# EAGLE design alim (EAGLE 8.7.0)
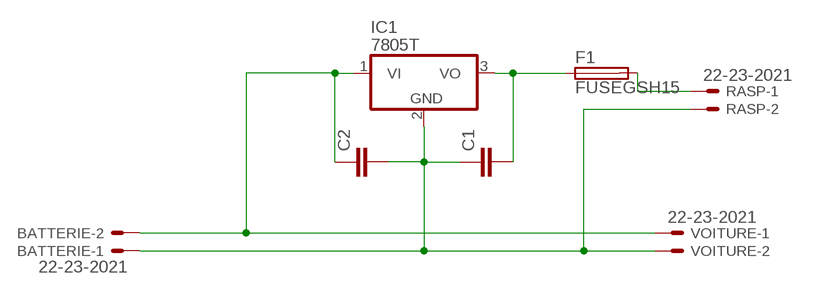
[diagram p0: schematic, sheet 1]

## Parts
BATTERIE  22-23-2021  [22-23-2021]
C1  C-EU025-025X050  [C025-025X050]
C2  C-EU025-025X050  [C025-025X050]
F1  FUSEGSH15  [GSH15]
IC1  7805T  [TO220H]
RASP  22-23-2021  [22-23-2021]
VOITURE  22-23-2021  [22-23-2021]

## Nets
N$1: BATTERIE.2 C2.1 IC1.1(VI) VOITURE.1
N$2: BATTERIE.1 C1.1 C2.2 IC1.2(GND) RASP.2 VOITURE.2
N$3: C1.2 F1.1 IC1.3(VO)
N$4: F1.2 RASP.1

## Library data of the parts
BATTERIE RASP VOITURE = con-molex:22-23-2021: .100" (2.54mm) Center Header - 2 Pin; MF: MOLEX; MPN: 22-23-2021; OC_FARNELL: 1462926; OC_NEWARK: 25C3832
C1 C2 = rcl:C-EU: CAPACITOR, European symbol; SPICEPREFIX: C
F1 = fuse:FUSE: Fuse; OC_FARNELL: unknown; OC_NEWARK: unknown
IC1 = linear:78*: Positive VOLTAGE REGULATOR Source: http://cache.national.com/ds/LM/LM78L05.pdf http://www.fairchildsemi.com/ds/LM/LM7805.pdf

## Board
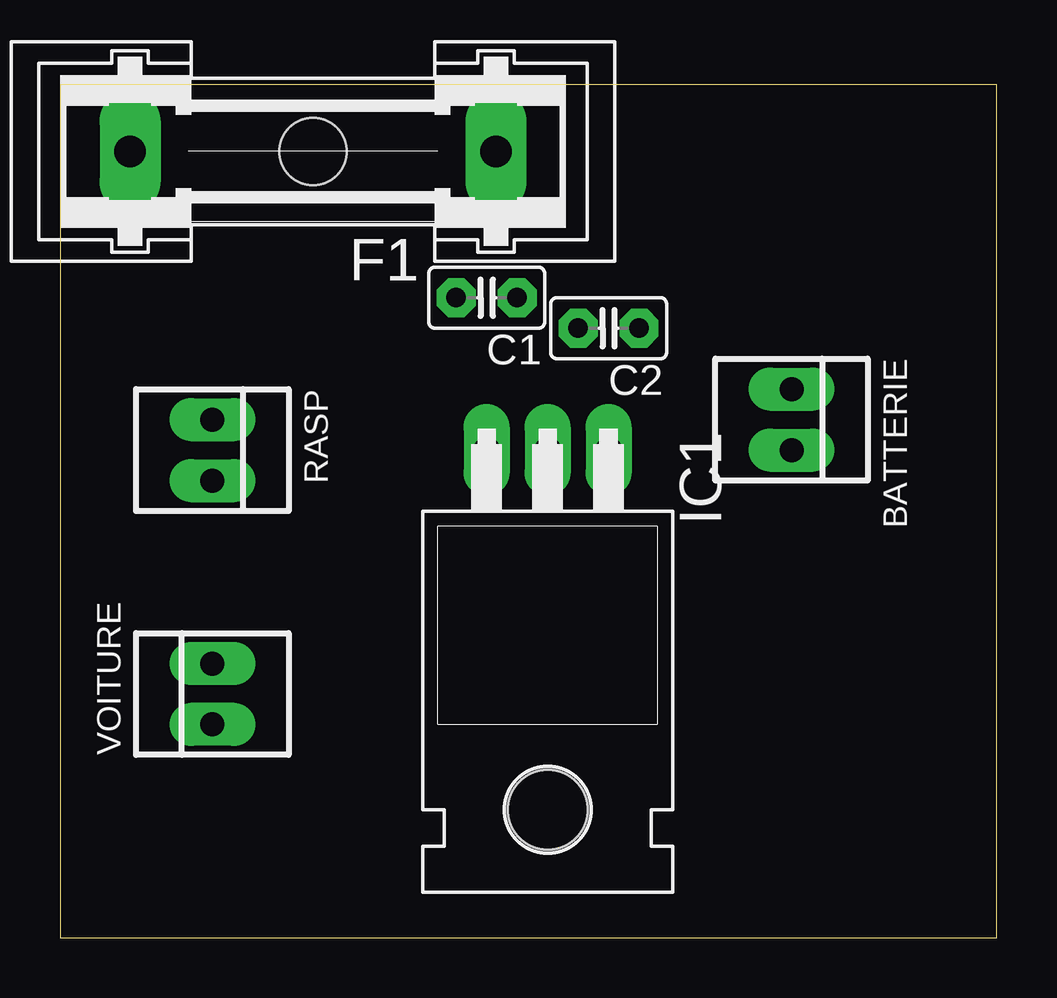
[diagram p1: board, top side]
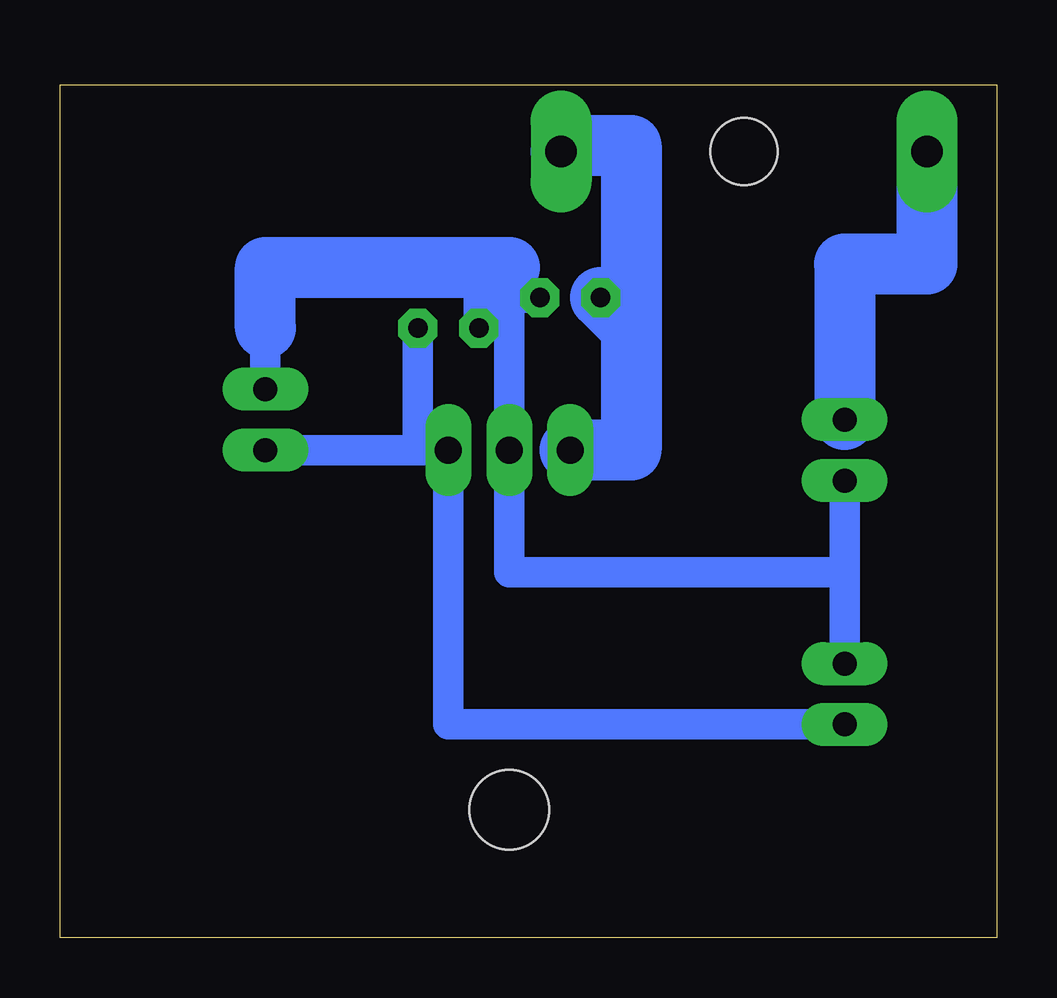
[diagram p2: board, bottom side, seen from below]

Size 39.04 x 35.55 mm. Coordinates in mm from the lower left corner, seen from the top.
Outline: 0,0 39.04,0 39.04,35.55 0,35.55 0,0
Copper layers (1*16): Top 0.035mm / dielectric 1.55mm / Bottom 0.035mm
Design rules "default": minimum track width 0.8mm, minimum drill 0.6mm, track to track 0.8mm, track to pad 0.7mm, pad to pad 0.7mm, via to via 0.7mm, smd to smd 0.1mm, copper to edge 0.45mm, drill to drill 0.3mm, minimum pad ring 0.4mm, minimum via ring 0.4mm, stop-mask expansion 0.1mm, vias tented up to drill 0mil, thermal gap 0.4mm

### Footprints (pad centres in the part's own frame; a part is rotated, then mirrored left to right if it is on the bottom)
22-23-2021 = drill 1 long: 1 -1.27,0; 2 1.27,0
C025-025X050 = drill 0.813 octagon: 1 -1.27,0; 2 1.27,0
GSH15 = drill 1.321 pad 2.54 long: 1 -7.62,0; 2 7.62,0 | hole 2.794: 0,0
TO220H = drill 1.118 long: 1 -2.54,-10.16; 2 0,-10.16; 3 2.54,-10.16 | hole 3.302: 0,4.826

### Placement (x,y rotation side)
BATTERIE  30.48,21.59 270 top
C1  17.78,26.67 180 top
C2  22.86,25.4 180 top
F1  10.54,32.77 180 top
IC1  20.32,10.16 180 top
RASP  6.35,20.32 270 top
VOITURE  6.35,10.16 90 top

### Tracks (layer width: path | path; a pad name or v marks a point on that pad's centre or on a via)
N$1
  Bottom 1.27: IC1.1 BATTERIE.2 | C2.1 24.13,20.32 IC1.1 | VOITURE.1 22.86,8.89 IC1.1
N$2
  Bottom 1.27: C1.1 20.32,26.67 | 20.32,26.67 21.59,26.67 C2.2 | 20.32,26.67 IC1.2 20.32,15.24 6.35,15.24 | BATTERIE.1 30.48,25.4 | 20.32,27.94 20.32,26.67 | RASP.2 6.35,15.24 | 6.35,15.24 VOITURE.2 | 30.48,25.4
  Bottom 2.54: 30.48,25.4 30.48,27.94 20.32,27.94
N$3
  Bottom 1.27: F1.1 16.51,32.77
  Bottom 2.54: F1.1 17.91,33.02 15.24,33.02 15.24,25.4 | 15.24,25.4 15.24,20.32 IC1.3 | C1.2 15.24,25.4
N$4
  Bottom 1.27: 2.92,30.48
  Bottom 2.54: F1.2 2.92,30.48 2.92,28.07 6.35,28.07 RASP.1